# Altium schematic sheet Sheet1.SchDoc: RTC
size A4; SheetNumber: 1; SheetTotal: 9
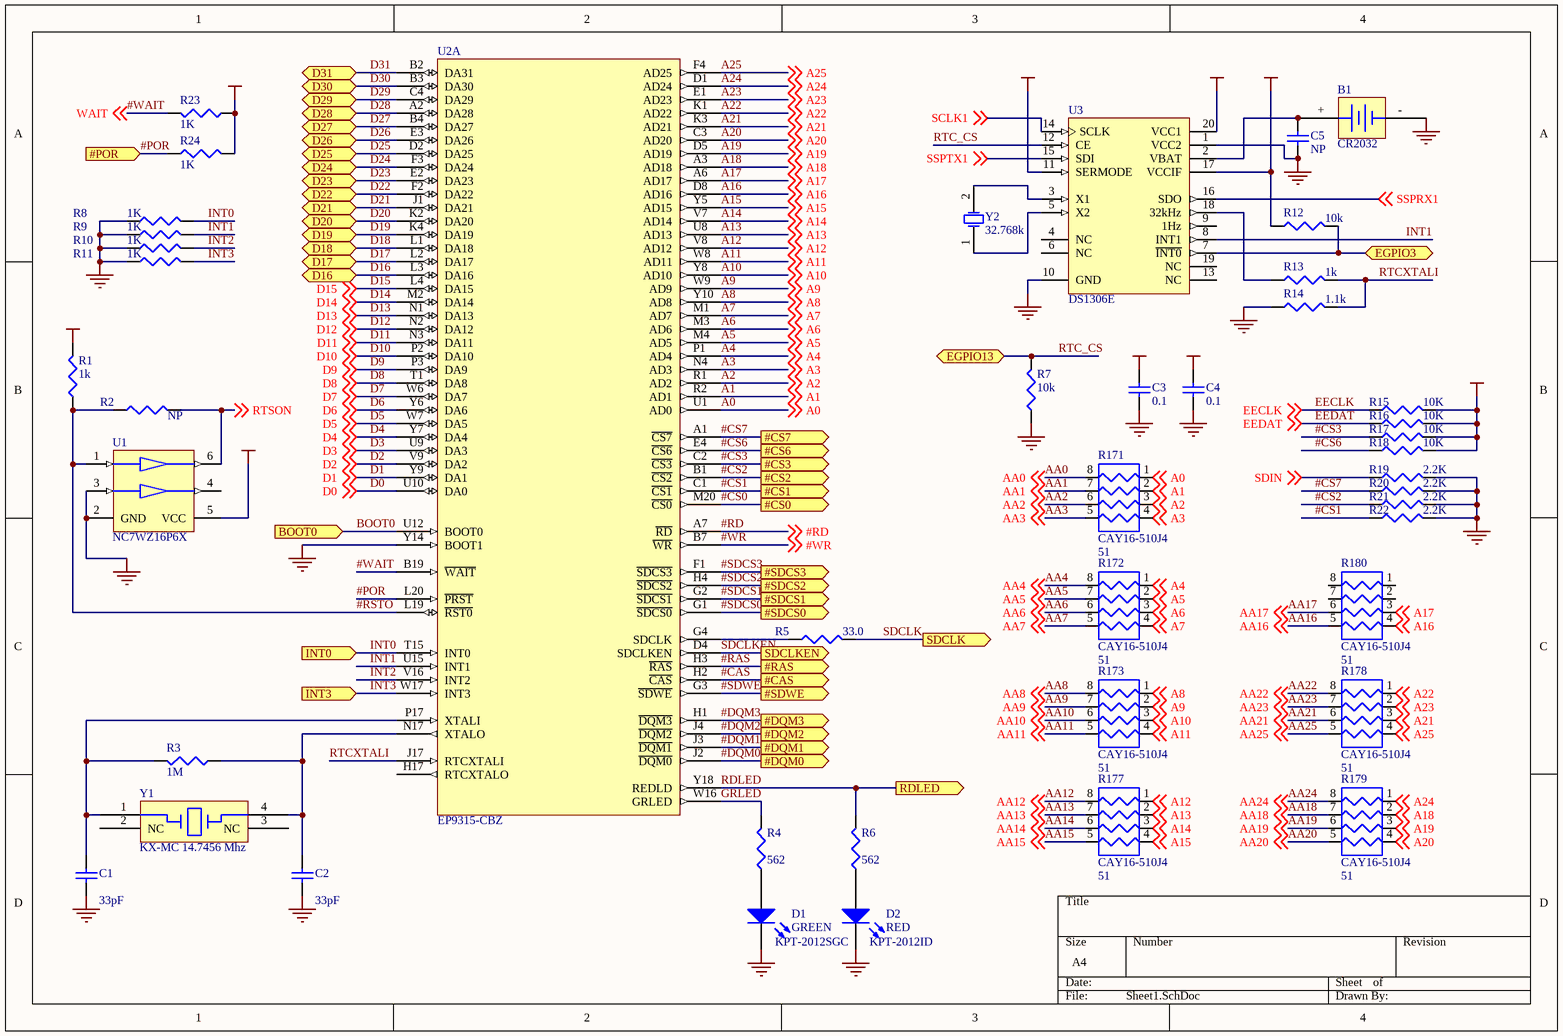
[diagram p0: Sheet1.SchDoc]

## Parts
B1  CR2032  [CR2032]
C1  33pF  [0603]
C2  33pF  [0603]
C3  0.1  [0603]
C4  0.1  [0603]
C5  NP  [0603]
D1  GREEN  value KPT-2012SGC  [DSO-F2/D6.1]
D2  RED  value KPT-2012ID  [DSO-F2/D6.1]
R1  1k  [CR1608-0603]
R2  NP  [CR1608-0603]
R3  1M  [CR1608-0603]
R4  562  [CR1608-0603]
R5  value 33.0  [CR1608-0603]  (hidden comment: 33)
R6  562  [CR1608-0603]
R7  10k  [CR1608-0603]
R8  1k  [CR1608-0603]
R9  1k  [CR1608-0603]
R10  1k  [CR1608-0603]
R11  1k  [CR1608-0603]
R12  10k  [CR1608-0603]
R13  1k  [CR1608-0603]
R14  1.1k  [CR1608-0603]
R15  10k  [CR1608-0603]
R16  10k  [CR1608-0603]
R17  10k  [CR1608-0603]
R18  10k  [CR1608-0603]
R19  2.2k  [CR1608-0603]
R20  2.2k  [CR1608-0603]
R21  2.2k  [CR1608-0603]
R22  2.2k  [CR1608-0603]
R23  1k  [CR1608-0603]
R24  1k  [CR1608-0603]
R171  CAY16-510J4  value 51  [CAY16-J4]
R172  CAY16-510J4  value 51  [CAY16-J4]
R173  CAY16-510J4  value 51  [CAY16-J4]
R177  CAY16-510J4  value 51  [CAY16-J4]
R178  CAY16-510J4  value 51  [CAY16-J4]
R179  CAY16-510J4  value 51  [CAY16-J4]
R180  CAY16-510J4  value 51  [CAY16-J4]
U1  NC7WZ16P6X  [SC88]
U2  EP9315-CBZ  [BGA352x20]  (part A of 4)
U3  DS1306E  [TSSOP20]
Y1  KX-MC 14.7456 Mhz  [KX-MC]
Y2  32.768k  [BCY-W2/D3.1]

## Ports
#CAS (out), #CS0 (out), #CS1 (out), #CS2 (out), #CS3 (out), #CS6 (out), #CS7 (out), #DQM0 (out), #DQM1 (out), #DQM2 (out), #DQM3 (out), #POR (in), #RAS (out), #SDCS0 (out), #SDCS1 (out), #SDCS2 (out), #SDCS3 (out), #SDWE (out), BOOT0 (in), D16 (bidir), D17 (bidir), D18 (bidir), D19 (bidir), D20 (bidir), D21 (bidir), D22 (bidir), D23 (bidir), D24 (bidir), D25 (bidir), D26 (bidir), D27 (bidir), D28 (bidir), D29 (bidir), D30 (bidir), D31 (bidir), EGPIO3 (bidir), EGPIO13 (bidir), INT0 (in), INT3 (in), RDLED (out), SDCLK (out), SDCLKEN (out)

## Nets
GND: B1.- C1.1 C2.1 C3.1 C4.1 C5.1 D1.2(K) D2.2(K) R7.1 R8.1 R9.1 R10.1 R11.1 R14.1 R19.2 R20.2 R21.2 R22.2 U1.2(GND) U1.3(B) U2.Y14(BOOT1) U3.1(VCC2) U3.10(GND)
VCC5V0: C4.2 U3.20(VCC1)
VCCIO: C3.2 R1.2 R12.1 R15.2 R16.2 R17.2 R18.2 R23.1 R24.2 U1.5(VCC) U3.11(SERMODE) U3.17(VCCIF)
#CAS: U2.H2(~{CAS}) ; port #CAS
#CS0: U2.M20(~{CS0}) ; port #CS0
#CS1: R22.1 U2.C1(~{CS1}) ; port #CS1
#CS2: R21.1 U2.B1(~{CS2}) ; port #CS2
#CS3: R17.1 U2.C2(~{CS3}) ; port #CS3
#CS6: R18.1 U2.E4(~{CS6}) ; port #CS6
#CS7: R20.1 U2.A1(~{CS7}) ; port #CS7
#DQM0: U2.J2(~{DQM0}) ; port #DQM0
#DQM1: U2.J3(~{DQM1}) ; port #DQM1
#DQM2: U2.J4(~{DQM2}) ; port #DQM2
#DQM3: U2.H1(~{DQM3}) ; port #DQM3
#POR: R24.1 U2.L20(~{PRST}) ; port #POR
#RAS: U2.H3(~{RAS}) ; port #RAS
#RD: U2.A7(~{RD}) ; off-sheet #RD
#RSTO: R1.1 R2.1 U1.1(A) U2.L19(~{RST0})
#SDCS0: U2.G1(~{SDCS0}) ; port #SDCS0
#SDCS1: U2.G2(~{SDCS1}) ; port #SDCS1
#SDCS2: U2.H4(~{SDCS2}) ; port #SDCS2
#SDCS3: U2.F1(~{SDCS3}) ; port #SDCS3
#SDWE: U2.G3(~{SDWE}) ; port #SDWE
#WAIT: R23.2 U2.B19(~{WAIT}) ; off-sheet WAIT  [also labelled WAIT]
#WR: U2.B7(~{WR}) ; off-sheet #WR
A0: R171.1 U2.U1(AD0) ; off-sheet A0
A1: R171.2 U2.R2(AD1) ; off-sheet A1
A2: R171.3 U2.R1(AD2) ; off-sheet A2
A3: R171.4 U2.N4(AD3) ; off-sheet A3
A4: R172.1 U2.P1(AD4) ; off-sheet A4
A5: R172.2 U2.M4(AD5) ; off-sheet A5
A6: R172.3 U2.M3(AD6) ; off-sheet A6
A7: R172.4 U2.M1(AD7) ; off-sheet A7
A8: R173.1 U2.Y10(AD8) ; off-sheet A8
A9: R173.2 U2.W9(AD9) ; off-sheet A9
A10: R173.3 U2.Y8(AD10) ; off-sheet A10
A11: R173.4 U2.W8(AD11) ; off-sheet A11
A12: R177.1 U2.V8(AD12) ; off-sheet A12
A13: R177.2 U2.U8(AD13) ; off-sheet A13
A14: R177.3 U2.V7(AD14) ; off-sheet A14
A15: R177.4 U2.Y5(AD15) ; off-sheet A15
A16: R180.4 U2.D8(AD16) ; off-sheet A16
A17: R180.3 U2.A6(AD17) ; off-sheet A17
A18: R179.2 U2.A3(AD18) ; off-sheet A18
A19: R179.3 U2.D5(AD19) ; off-sheet A19
A20: R179.4 U2.C3(AD20) ; off-sheet A20
A21: R178.3 U2.K3(AD21) ; off-sheet A21
A22: R178.1 U2.K1(AD22) ; off-sheet A22
A23: R178.2 U2.E1(AD23) ; off-sheet A23
A24: R179.1 U2.D1(AD24) ; off-sheet A24
A25: R178.4 U2.F4(AD25) ; off-sheet A25
AA0: R171.8 ; off-sheet AA0
AA1: R171.7 ; off-sheet AA1
AA2: R171.6 ; off-sheet AA2
AA3: R171.5 ; off-sheet AA3
AA4: R172.8 ; off-sheet AA4
AA5: R172.7 ; off-sheet AA5
AA6: R172.6 ; off-sheet AA6
AA7: R172.5 ; off-sheet AA7
AA8: R173.8 ; off-sheet AA8
AA9: R173.7 ; off-sheet AA9
AA10: R173.6 ; off-sheet AA10
AA11: R173.5 ; off-sheet AA11
AA12: R177.8 ; off-sheet AA12
AA13: R177.7 ; off-sheet AA13
AA14: R177.6 ; off-sheet AA14
AA15: R177.5 ; off-sheet AA15
AA16: R180.5 ; off-sheet AA16
AA17: R180.6 ; off-sheet AA17
AA18: R179.7 ; off-sheet AA18
AA19: R179.6 ; off-sheet AA19
AA20: R179.5 ; off-sheet AA20
AA21: R178.6 ; off-sheet AA21
AA22: R178.8 ; off-sheet AA22
AA23: R178.7 ; off-sheet AA23
AA24: R179.8 ; off-sheet AA24
AA25: R178.5 ; off-sheet AA25
BOOT0: U2.U12(BOOT0) ; port BOOT0
D0: U2.U10(DA0) ; off-sheet D0
D1: U2.Y9(DA1) ; off-sheet D1
D2: U2.V9(DA2) ; off-sheet D2
D3: U2.U9(DA3) ; off-sheet D3
D4: U2.Y7(DA4) ; off-sheet D4
D5: U2.W7(DA5) ; off-sheet D5
D6: U2.Y6(DA6) ; off-sheet D6
D7: U2.W6(DA7) ; off-sheet D7
D8: U2.T1(DA8) ; off-sheet D8
D9: U2.P3(DA9) ; off-sheet D9
D10: U2.P2(DA10) ; off-sheet D10
D11: U2.N3(DA11) ; off-sheet D11
D12: U2.N2(DA12) ; off-sheet D12
D13: U2.N1(DA13) ; off-sheet D13
D14: U2.M2(DA14) ; off-sheet D14
D15: U2.L4(DA15) ; off-sheet D15
D16: U2.L3(DA16) ; port D16
D17: U2.L2(DA17) ; port D17
D18: U2.L1(DA18) ; port D18
D19: U2.K4(DA19) ; port D19
D20: U2.K2(DA20) ; port D20
D21: U2.J1(DA21) ; port D21
D22: U2.F2(DA22) ; port D22
D23: U2.E2(DA23) ; port D23
D24: U2.F3(DA24) ; port D24
D25: U2.D2(DA25) ; port D25
D26: U2.E3(DA26) ; port D26
D27: U2.B4(DA27) ; port D27
D28: U2.A2(DA28) ; port D28
D29: U2.C4(DA29) ; port D29
D30: U2.B3(DA30) ; port D30
D31: U2.B2(DA31) ; port D31
EECLK: R15.1 ; off-sheet EECLK
EEDAT: R16.1 ; off-sheet EEDAT
EGPIO3: R12.2 U3.7(~{INT0}) ; port EGPIO3
GRLED: R4.2 U2.W16(GRLED)
INT0: R8.2 U2.T15(INT0) ; port INT0
INT1: R9.2 U2.U15(INT1) U3.8(INT1)
INT2: R10.2 U2.V16(INT2)
INT3: R11.2 U2.W17(INT3) ; port INT3
RDLED: R6.2 U2.Y18(REDLD) ; port RDLED
RTC_CS: R7.2 U3.12(CE) ; port EGPIO13
RTCXTALI: R13.2 R14.2 U2.J17(RTCXTALI)
RTSON: R2.2 U1.6(Y) ; off-sheet RTSON
SCLK1: U3.14(SCLK) ; off-sheet SCLK1
SDCLK: R5.2 ; port SDCLK
SDCLKEN: U2.D4(SDCLKEN) ; port SDCLKEN
SDIN: R19.1 ; off-sheet SDIN
SSPRX1: U3.16(SDO) ; off-sheet SSPRX1
SSPTX1: U3.15(SDI) ; off-sheet SSPTX1
NetB1_+: B1.+ C5.2 U3.2(VBAT)
NetC1_2: C1.2 R3.2 U2.P17(XTALI) Y1.1
NetC2_2: C2.2 R3.1 U2.N17(XTALO) Y1.4
NetD1_1: D1.1(A) R4.1
NetD2_1: D2.1(A) R6.1
NetR5_1: R5.1 U2.G4(SDCLK)
NetR13_1: R13.1 U3.18(32kHz)
NetU3_3: U3.3(X1) Y2.2(OSC2)
NetU3_5: U3.5(X2) Y2.1(OSC1)

Not connected (* = marked no-connect by the designer): R180 1 2 7 8; U1 4(Y); U2 H17(RTCXTALO); U3 4(NC) 6(NC) 9(1Hz) 13(NC) 19(NC); Y1 2(NC) 3(NC)

## Library data of the parts
B1 = CR2032: CR2032 Battery holder
C1-C4 = C0603: Ceramic Chip Capacitor - Standard; Note: Footprint corresponds to dimensions for bulk cassette packaging. This case size has tightened tolerances.; Published: 17-Jul-2002; LatestRevisionDate: 19-Mar-2004; LatestRevisionNote: Silkscreen size reduced.; DatasheetDocument: Mar-2001; PackageDocument: Mar-2001; PackageReference: 0603; Publisher: Altium Limited; Code_JEITA: 0603; Code_IPC: 1608 [0603]; ComponentLink1Description: Manufacturer Link; ComponentLink1URL: http://www.kemet.com/; ComponentLink2Description: Datasheet; ComponentLink2URL: http://www.kemet.com/kemet/web/homepage/kechome.nsf/vapubfilesname/F3102TA.pdf/$file/F3102TA.pdf
  C1 C2: Value: 33pF
  C3 C4: Value: 0.1
C5 = C0603: Ceramic Chip Capacitor - Standard; Note: Footprint corresponds to dimensions for bulk cassette packaging. This case size has tightened tolerances.; Value: 0.1; Published: 17-Jul-2002; LatestRevisionDate: 19-Mar-2004; LatestRevisionNote: Silkscreen size reduced.; DatasheetDocument: Mar-2001; PackageDocument: Mar-2001; PackageReference: 0603; Publisher: Altium Limited; Code_JEITA: 0603; Code_IPC: 1608 [0603]; ComponentLink1Description: Manufacturer Link; ComponentLink1URL: http://www.kemet.com/; ComponentLink2Description: Datasheet; ComponentLink2URL: http://www.kemet.com/kemet/web/homepage/kechome.nsf/vapubfilesname/F3102TA.pdf/$file/F3102TA.pdf
D1 D2 = LED2: Typical RED, GREEN, YELLOW, AMBER GaAs LED; Published: 8-Jun-2000; Revision: July-2002: Re-released for DXP Platform.; Publisher: Altium Limited
R1-R24 = Res3: Resistor; Published: 8-Jun-2000; Revision: July-2002: Re-released for DXP Platform.; Publisher: Altium Limited
  R1 R13: Value: 1k
  R2: Value: NP
  R3: Value: 1M
  R4 R6: Value: 562
  R7 R12: Value: 10k
  R8-R11 R23 R24: Value: 1K
  R14: Value: 1.1k
  R15-R18: Value: 10K
  R19-R22: Value: 2.2K
R171-R173 R177-R180 = CAY16-J4: Chip Resistor Arrays
U1 = NC7WZ16P6X: TinyLogic UHS Dual Buffer
U2 = EP9315-CBZ: 32 Bit ARM920T Microcontroller with inegrated graphics, IDE, PCMCIA, Ethernet
U3 = DS1306E: Serial Alarm Real-Time Clock
Y1 = QRZ_KX_MC: QUARTZ CRYSTAL
Y2 = ECS-110-S-5P: Crystal Oscillator; Published: 17-Jul-2002; Datasheet: Latest Revision: 18-Apr-2000; Package Reference: CSM-7; Publisher: Altium Limited